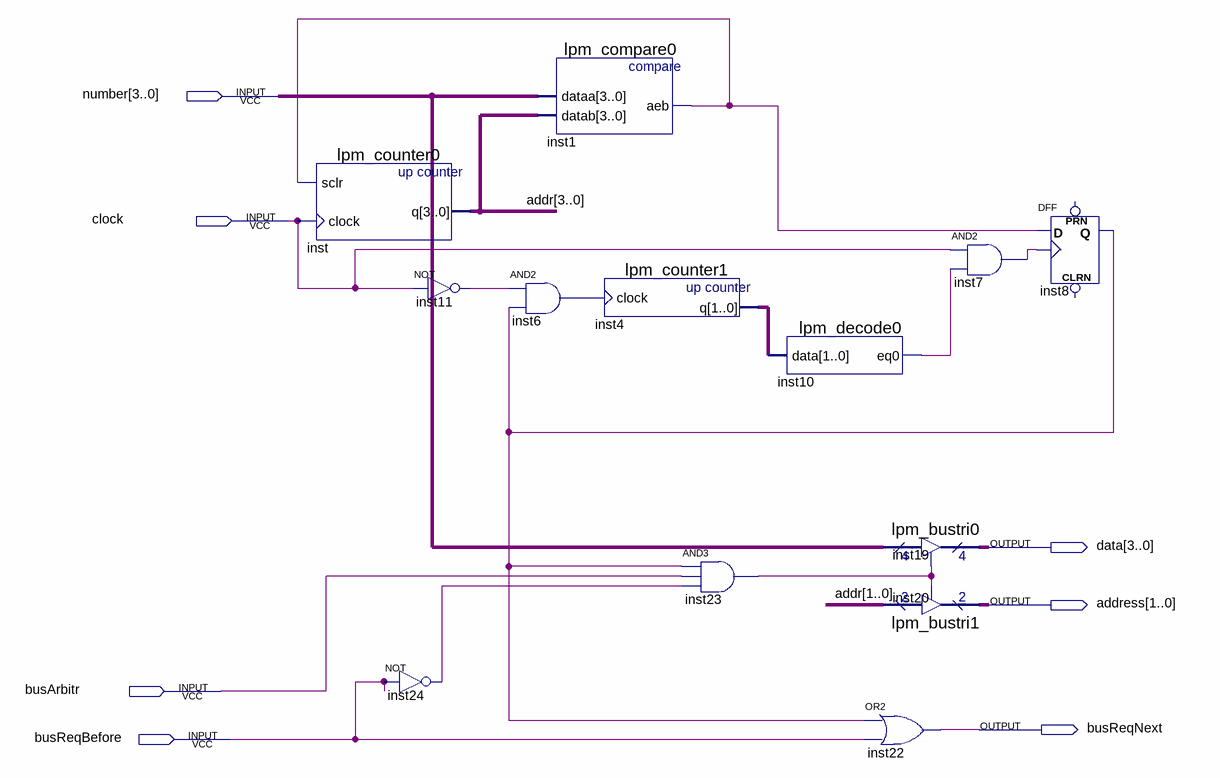
[diagram p0: schematic sheet]
// Quartus schematic master.bdf as structural Verilog: 13 symbols, 7 pins
module master (
  input  [3:0] number,
  input  clock,
  input  busArbitr,
  input  busReqBefore,
  output [3:0] data,
  output [1:0] address,
  output busReqNext
);

  wire inst1_aeb, inst6_out, inst7_out, inst8_q, inst10_eq0, inst11_out, inst23_out, inst24_out;
  wire [1:0] inst4_q;
  wire [3:0] addr;

  lpm_counter0 inst (.sclr(inst1_aeb), .clock(clock), .q(addr));
  not inst11 (inst11_out, clock);
  not inst24 (inst24_out, busReqBefore);
  lpm_compare0 inst1 (.dataa(number), .datab(addr), .aeb(inst1_aeb));
  and inst6 (inst6_out, inst11_out, inst8_q);
  lpm_counter1 inst4 (.clock(inst6_out), .q(inst4_q));
  and inst23 (inst23_out, inst8_q, busArbitr, inst24_out);
  lpm_decode0 inst10 (.data(inst4_q), .eq0(inst10_eq0));
  lpm_bustri0 inst19 (.enabledt(inst23_out), .data(number), .tridata(data));
  lpm_bustri1 inst20 (.enabledt(inst23_out), .data(addr[1:0]), .tridata(address));
  or inst22 (busReqNext, inst8_q, busReqBefore);
  and inst7 (inst7_out, clock, inst10_eq0);
  DFF inst8 (.CLK(inst7_out), .D(inst1_aeb), .Q(inst8_q));  // open: CLRN, PRN
endmodule
